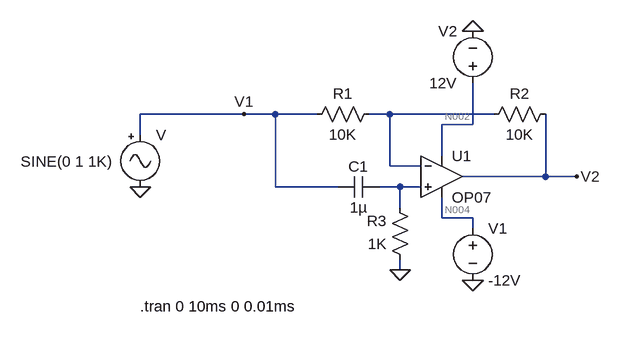
[diagram p0: schematic TS1.asc]
TS1.asc, the LTspice schematic file:
Version 4
SHEET 1 1996 680
WIRE 144 272 -16 272
WIRE 192 272 144 272
WIRE 256 272 192 272
WIRE 368 272 336 272
WIRE 528 272 368 272
WIRE 496 288 496 224
WIRE 496 288 448 288
WIRE -16 304 -16 272
WIRE 448 336 448 288
WIRE 368 352 368 272
WIRE 416 352 368 352
WIRE 608 368 608 272
WIRE 608 368 480 368
WIRE 656 368 608 368
WIRE 192 384 192 272
WIRE 288 384 192 384
WIRE 384 384 352 384
WIRE 416 384 384 384
WIRE 384 416 384 384
WIRE 448 432 448 400
WIRE 496 432 448 432
WIRE 496 448 496 432
WIRE 384 512 384 496
FLAG 384 512 0
FLAG 144 272 V1
FLAG 656 368 V2
FLAG 496 144 0
FLAG 496 528 0
FLAG -16 384 0
SYMBOL res 352 256 R90
WINDOW 0 0 56 VBottom 2
WINDOW 3 32 56 VTop 2
SYMATTR InstName R1
SYMATTR Value 10K
SYMBOL res 512 288 R270
WINDOW 0 32 56 VTop 2
WINDOW 3 0 56 VBottom 2
SYMATTR InstName R2
SYMATTR Value 10K
SYMBOL OpAmps/OP07 448 304 R0
SYMATTR InstName U1
SYMBOL cap 352 368 R90
WINDOW 0 0 32 VBottom 2
WINDOW 3 32 32 VTop 2
SYMATTR InstName C1
SYMATTR Value 1µ
SYMBOL res 400 512 R180
WINDOW 0 36 76 Left 2
WINDOW 3 36 40 Left 2
SYMATTR InstName R3
SYMATTR Value 1K
SYMBOL voltage 496 432 R0
SYMATTR InstName V1
SYMATTR Value -12V
SYMBOL voltage 496 240 R180
WINDOW 0 24 96 Left 2
WINDOW 3 24 16 Left 2
SYMATTR InstName V2
SYMATTR Value 12V
SYMBOL Misc/signal -16 288 R0
WINDOW 3 -184 57 Left 2
SYMATTR InstName V
SYMATTR Value2 AC 1
TEXT -16 568 Left 2 !.tran 0 10ms 0 0.01ms

The netlist it stands for:
* TS1.asc
R1 N001 V1 10K
R2 N001 V2 10K
XU1 N003 N001 N002 N004 V2 LT1001  ; OP07, pins In+ In- V+ V- OUT
C1 N003 V1 1µ
R3 0 N003 1K
V1 N004 0 -12V
V2 N002 0 12V
V V1 0 SINE(0 1 1K) AC 1
.tran 0 10ms 0 0.01ms
.lib LTC.lib
.backanno
.end

* Results of the author's LTspice run, read from the files saved beside the schematic
* Operating Point, zero values left out:
*   V(n002) = 12 V
*   V(n004) = -12 V
*   I(V2) = -2.25 mA
*   I(V1) = 2.25 mA
*   Ix(u1:3) = 2.25 mA
*   Ix(u1:4) = -2.25 mA